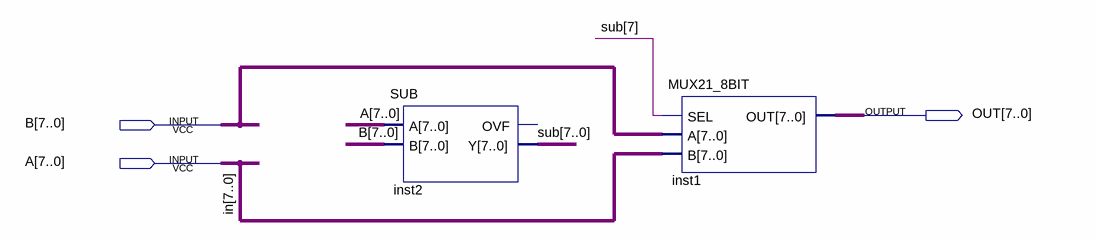
[diagram p0: schematic sheet]
// Quartus schematic MIN.bdf as structural Verilog: 2 symbols, 3 pins
module MIN (
  input  [7:0] B,
  input  [7:0] A,
  output [7:0] OUT
);

  wire [7:0] in, sub;

  SUB inst2 (.A(A), .B(B), .Y(sub));  // open: OVF
  MUX21_8BIT inst1 (.SEL(sub[7]), .A(B), .B(in), .OUT(OUT));
endmodule
